# EAGLE board calculator_15-Digit (EAGLE 6.6.0), part 1 of 2
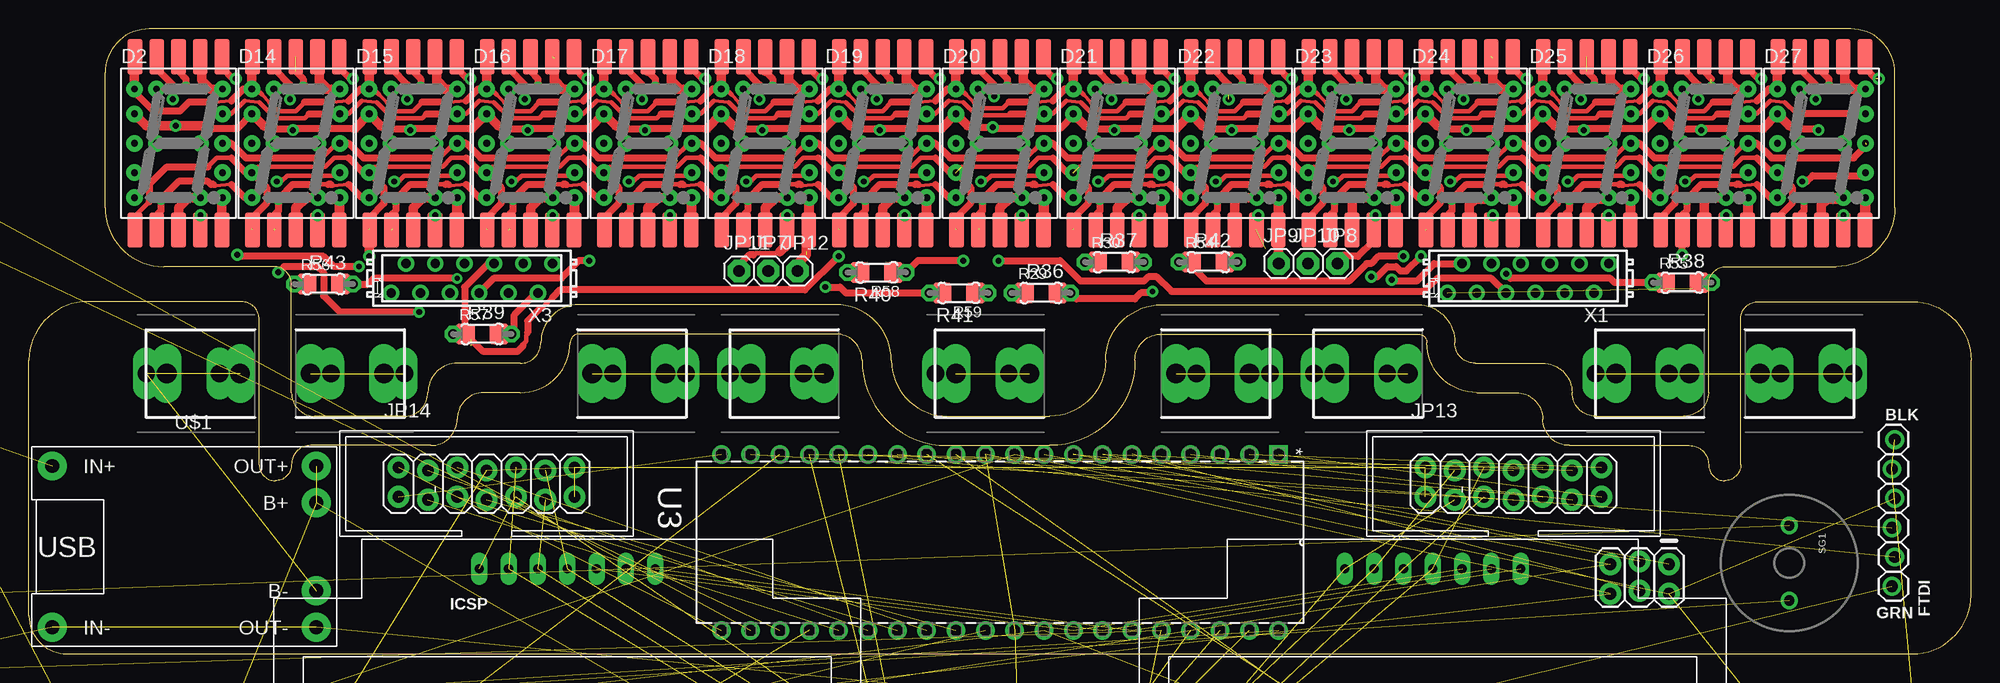
[diagram p4: board, top side]
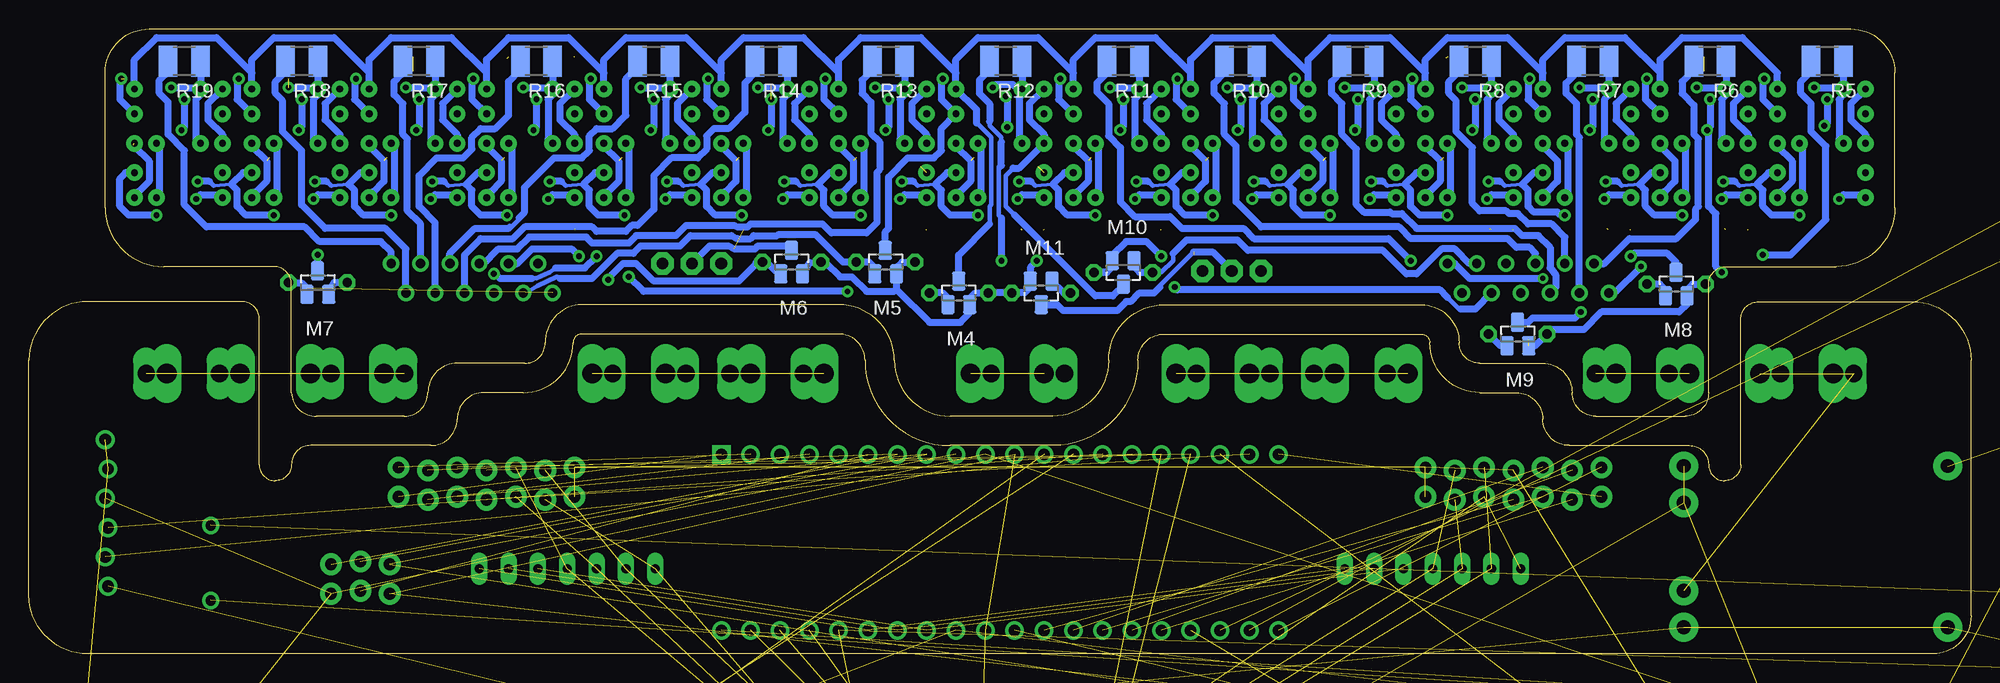
[diagram p5: board, bottom side, seen from below]

Size 168.15 x 54.1 mm. Coordinates in mm from the lower left corner, seen from the top.
Outline: 161.54,50.29 arc90 157.73,54.1
Outline: 10.41,54.1 arc90 6.6,50.29
Outline: 161.54,50.29 arc90 157.73,54.1
Outline: 10.41,54.1 arc90 6.6,50.29
Outline: 161.54,50.29 arc90 157.73,54.1
Outline: 10.41,54.1 arc90 6.6,50.29
Outline: 161.54,50.29 arc90 157.73,54.1
Outline: 10.41,54.1 arc90 6.6,50.29
Outline: 161.54,50.29 arc90 157.73,54.1
Outline: 157.73,54.1 10.41,54.1
Outline: 10.41,54.1 arc90 6.6,50.29
Outline: 6.6,50.29 6.6,38.61 arc90 11.68,33.53 21.21,33.53 arc-90 22.73,32 22.73,22.61 arc90 24.77,20.57 32.51,20.57 arc90 34.54,22.61 arc-90 37.08,25.15 42.55,25.15 arc90 44.32,26.92 arc-90 47.62,30.23 69.85,30.23 arc-90 74.68,25.4 arc90 79.5,20.57 88.39,20.57 arc90 93.22,25.4 arc-90 98.04,30.23 120.27,30.23 arc-90 123.44,26.92 arc90 125.22,25.15 131.06,25.15 arc-90 133.6,22.61 arc90 135.64,20.57 143.26,20.57 arc90 145.42,22.61 145.42,32 arc-90 146.94,33.53 156.46,33.53 arc90 161.54,38.61 161.54,50.29
Outline: 0,3.3 arc90 3.3,0 163.07,0 arc90 168.15,5.08 168.15,25.4 arc90 163.07,30.48 149.61,30.48 arc90 148.21,28.96 148.21,16.38 arc-90 146.81,14.99 arc-90 145.42,16.38 arc90 143.76,18.03 133.35,18.03 arc-90 131.06,20.32 arc90 128.78,22.61 125.35,22.61 arc-90 121.03,26.92 arc90 120.27,27.69 98.04,27.69 arc90 95.76,25.4 arc-90 88.39,18.03 79.5,18.03 arc-90 72.14,25.4 arc90 69.85,27.69 47.62,27.69 arc90 46.86,26.92 arc-90 42.55,22.61 39.37,22.61 arc90 37.08,20.32 arc-90 34.8,18.03 24.38,18.03 arc90 22.73,16.38 arc-90 21.34,14.99 arc-90 19.94,16.38 19.94,28.96 arc90 18.41,30.48 5.08,30.48 arc90 0,25.4 0,3.3
Copper layers (1*16): Top 0.035mm / dielectric 1.5mm / Bottom 0.035mm
Design rules "OSHPark-8mil-2layer": minimum track width 10mil, minimum drill 15mil, track to track 8mil, track to pad 8mil, pad to pad 8mil, via to via 8mil, smd to smd 8mil, copper to edge 8mil, drill to drill 8mil, minimum pad ring 12mil, minimum via ring 10mil, stop-mask expansion 4mil, vias tented up to drill 20mil, thermal gap 10mil
Net classes: 0 default: clearance 0.205 mm; 1 vcc: width 0.254 mm

## Footprints (pad centres in the part's own frame; a part is rotated, then mirrored left to right if it is on the bottom)
BATTERY-AAA-LEFT = drill 1.7 long: P1 -2.54,0; P2 3.81,0 | drill 1.5 long: P3 2.032,0; P4 -4.318,0
BATTERY-AAA-RIGHT = drill 1.7 long: M1 -3.81,0; M2 2.54,0 | drill 1.5 long: M3 4.318,0; M4 -2.032,0
C025_050-025X075 = drill 0.813 octagon: 1 -1.27,0; 2 1.27,0; 3 3.81,0
C1206K = smd 1.5 x 2: 1 -1.5,0; 2 1.5,0
C025-024X044 = drill 0.813 pad 1.422 octagon: 1 -1.27,0; 2 1.27,0
0805 = smd 0.8 x 1.2: 1 -0.9,0; 2 0.9,0
EIA3216 = smd 1.4 x 1.6: A 1.4,0; C -1.4,0
SMADIODE = smd 2.54 x 2.54: A 2.349,0; C -2.349,0
10MM_UNI = drill 0.6 pad 1.422: 1 -3.81,4.699; 2 -3.81,2.54; 3 -3.81,0; 4 -3.81,-2.54; 5 -3.81,-4.699; 6 3.81,-4.699; 7 3.81,-2.54; 8 3.81,0; 9 3.81,2.54; 10 3.81,4.699; 11 -1.905,4.699; 12 -1.905,0; 13 1.905,0; 14 1.905,-4.699 | smd 1.27 x 3.048: 21 -3.76,-7.5; 22 -1.88,-7.5; 23 0,-7.5; 24 1.88,-7.5; 25 3.76,-7.5; 26 3.76,7.5; 27 1.88,7.5; 28 0,7.5; 29 -1.88,7.5; 30 -3.76,7.5
SOT89 = smd 1 x 1.5: 1 -1.499,-1.981; 3 1.499,-1.981 | smd 1 x 2: 2 0,-1.727 | smd 2.2 x 3.7: 2@1 0,0.94
1X01-CLEANBIG = drill 1.016 pad 1.778: 1 0,0
2X3_LOCK = drill 1.016 pad 1.88: 1 0,0.127; 2 0,2.667; 3 2.54,-0.127; 4 2.54,2.413; 5 5.08,0.127; 6 5.08,2.667
1X06_LOCK = drill 1.016: 1 0,0; 2 2.54,-0.254; 3 5.08,0; 4 7.62,-0.254; 5 10.16,0; 6 12.7,-0.254
1X01 = drill 1.016 pad 1.93 octagon: 1 0,0
2X07 = drill 1.016 pad 1.88: 1 -7.62,-1.143; 2 -7.62,1.397; 3 -5.08,-1.397; 4 -5.08,1.143; 5 -2.54,-1.143; 6 -2.54,1.397; 7 0,-1.397; 8 0,1.143; 9 2.54,-1.143; 10 2.54,1.397; 11 5.08,-1.397; 12 5.08,1.143; 13 7.62,-1.143; 14 7.62,1.397
KEYPAD = drill 0.8 long: C_0 -2.54,0; C_1 -5.08,0; C_2 -7.62,0; R_0 0,0; R_1 2.54,0; R_2 5.08,0; R_3 7.62,0
SOT-23 = smd 1.143 x 1.651: 1 0.94,1.016; 2 -0.94,1.016; 3 0.025,-1.016
0204/7 = drill 0.813 octagon: 1 -3.81,0; 2 3.81,0
0204/5 = drill 0.813 octagon: 1 -2.54,0; 2 2.54,0
R1206 = smd 1.6 x 1.803: 1 -1.422,0; 2 1.422,0
R1210 = smd 1.6 x 2.7: 1 -1.4,0; 2 1.4,0
TACTILE-PTH-12MM = smd 2.3 x 2.4: P$1 7.1,-2.5; P$2 -7.1,-2.5; P$3 7.1,2.5; P$4 -7.1,2.5 | drill 1.2 long: P$11 6.25,-2.5; P$12 -6.25,-2.5; P$13 6.25,2.5; P$14 -6.25,2.5 | drill 1 long: P$15 0,-6.9; P$21 2.5,-2.5; P$22 -2.5,-2.5; P$23 2.5,2.5; P$24 -2.5,2.5 | hole 1.6: 0,4.5; 0,-4.5; 0,4.5; 0,-4.5
BUZZER-12MM-NS = drill 0.9: + 3.25,0; - -3.25,0
SO16 = smd 0.6 x 1.2: 1 -4.445,-2.8; 2 -3.175,-2.8; 3 -1.905,-2.8; 4 -0.635,-2.8; 5 0.635,-2.8; 6 1.905,-2.8; 7 3.175,-2.8; 8 4.445,-2.8; 9 4.445,2.8; 10 3.175,2.8; 11 1.905,2.8; 12 0.635,2.8; 13 -0.635,2.8; 14 -1.905,2.8; 15 -3.175,2.8; 16 -4.445,2.8
DIP254P1524X483-40 = drill 0.991 square: 1 -15.24,48.26 | drill 0.991: 2 -15.24,45.72; 3 -15.24,43.18; 4 -15.24,40.64; 5 -15.24,38.1; 6 -15.24,35.56; 7 -15.24,33.02; 8 -15.24,30.48; 9 -15.24,27.94; 10 -15.24,25.4; 11 -15.24,22.86; 12 -15.24,20.32; 13 -15.24,17.78; 14 -15.24,15.24; 15 -15.24,12.7; 16 -15.24,10.16; 17 -15.24,7.62; 18 -15.24,5.08; 19 -15.24,2.54; 20 -15.24,0; 21 0,0; 22 0,2.54; 23 0,5.08; 24 0,7.62; 25 0,10.16; 26 0,12.7; 27 0,15.24; 28 0,17.78; 29 0,20.32; 30 0,22.86; 31 0,25.4; 32 0,27.94; 33 0,30.48; 34 0,33.02; 35 0,35.56; 36 0,38.1; 37 0,40.64; 38 0,43.18; 39 0,45.72; 40 0,48.26
SOT23-5 = smd 0.55 x 1.2: 1 -0.95,-1.3; 2 0,-1.3; 3 0.95,-1.3; 4 0.95,1.3; 5 -0.95,1.3
BATTERY-CHARGER-LI-PROT = drill 1.2 pad 2.5: B+ 10.668,3.81; B- 10.668,-3.81; IN+ -12.192,6.985; IN- -12.192,-6.985; OUT+ 10.668,6.985; OUT- 10.668,-6.985
MICRO3 = smd 0.8 x 0.9: 1 -0.95,-1; 2 0.95,-1; 3 0,1
SOT89' = smd 0.559 x 1.194: GND -1.499,-0.597; VIN 0,-0.597; VOUT 1.499,-0.597 | smd 1.829 x 0.457: P$4 0,2.743
MICROMATCH-12 = drill 0.813: 1 6.985,1.27; 2 5.715,-1.27; 3 4.445,1.27; 4 3.175,-1.27; 5 1.905,1.27; 6 0.635,-1.27; 7 -0.635,1.27; 8 -1.905,-1.27; 9 -3.175,1.27; 10 -4.445,-1.27; 11 -5.715,1.27; 12 -6.985,-1.27
HC49U-V = drill 0.813: 1 -2.413,0; 2 2.413,0

## Placement (x,y rotation side)
BH4  HOLDER_AAA_LEFT1  [BATTERY-AAA-LEFT]  139.95,24.26 0 top
BH5  HOLDER_AAA_LEFT1  [BATTERY-AAA-LEFT]  82.8,24.26 0 top
BH6  HOLDER_AAA_RIGHT  [BATTERY-AAA-RIGHT]  28.19,24.26 0 top
BH7  HOLDER_AAA_LEFT1  [BATTERY-AAA-LEFT]  153.67,24.26 180 top
BH8  HOLDER_AAA_RIGHT  [BATTERY-AAA-RIGHT]  14.48,24.26 180 top
BH9  HOLDER_AAA_LEFT1  [BATTERY-AAA-LEFT]  115.57,24.26 0 top
BH10  HOLDER_AAA_RIGHT  [BATTERY-AAA-RIGHT]  52.58,24.26 0 top
BH11  HOLDER_AAA_LEFT1  [BATTERY-AAA-LEFT]  103.12,24.26 180 top
BH12  HOLDER_AAA_RIGHT  [BATTERY-AAA-RIGHT]  65.02,24.26 180 top
C1  100nF  [C025_050-025X075]  157.51,-46.99 180 top  (outside the outline)
C2  100nF  [C025_050-025X075]  170.1,-36.55 270 top  (outside the outline)
C3  100nF  [C025_050-025X075]  152.65,-36.27 270 top  (outside the outline)
C4  1µ  [C025_050-025X075]  -23.88,5.84 0 top  (outside the outline)
C5  100n  [C1206K]  -23.88,18.54 0 top  (outside the outline)
C6  10uF  [C025_050-025X075]  163.32,-20.04 0 top  (outside the outline)
C7  22pF  [C025-024X044]  159.33,-54.53 0 top  (outside the outline)
C8  22pF  [C025-024X044]  163.55,-56.06 180 top  (outside the outline)
C9  1µ  [C025_050-025X075]  -23.88,-1.78 0 top  (outside the outline)
C10  15n  [C1206K]  -26.42,-17.02 0 top  (outside the outline)
C11  1n  [0805]  -44.2,16 180 top  (outside the outline)
C12  0.1uF  [0805]  -28.96,-1.78 0 top  (outside the outline)
C14  1µ  [C025_050-025X075]  -9.53,17.78 270 top  (outside the outline)
C15  1µ  [C025_050-025X075]  -9.53,6.35 90 top  (outside the outline)
C16  0.1uF  [0805]  -54.36,-34.8 180 top  (outside the outline)
C18  100n  [C025_050-025X075]  -18.67,-22.22 0 top  (outside the outline)
C20  10uF  [EIA3216]  -54.36,-42.42 180 top  (outside the outline)
C21  10uF  [EIA3216]  -49.28,-34.8 180 top  (outside the outline)
C22  15n  [C1206K]  -49.28,-24.64 180 top  (outside the outline)
D1  SD103CW  [SMADIODE]  -51.82,-55.12 180 top  (outside the outline)
D2  SC40-11_UNISC40-11_UNI  [10MM_UNI]  12.95,44.2 0 top
D3  SD103CW  [SMADIODE]  -30.1,-4.45 0 top  (outside the outline)
D4  SD103CW  [SMADIODE]  5.33,-13.21 0 top  (outside the outline)
D5  SD103CW  [SMADIODE]  7.87,-9.4 0 top  (outside the outline)
D6  SD103CW  [SMADIODE]  -51.82,-47.5 180 top  (outside the outline)
D7  SD103CW  [SMADIODE]  -39.12,8.38 0 top  (outside the outline)
D8  SD103CW  [SMADIODE]  -59.44,-29.72 0 top  (outside the outline)
D9  SD103CW  [SMADIODE]  -46.74,41.4 0 top  (outside the outline)
D10  SD103CW  [SMADIODE]  -46.74,26.16 0 top  (outside the outline)
D11  SD103CW  [SMADIODE]  -26.42,-9.4 0 top  (outside the outline)
D12  SD103CW  [SMADIODE]  -26.42,-22.1 0 top  (outside the outline)
D14  SC40-11_UNISC40-11_UNI  [10MM_UNI]  23.11,44.2 0 top
D15  SC40-11_UNISC40-11_UNI  [10MM_UNI]  33.27,44.2 0 top
D16  SC40-11_UNISC40-11_UNI  [10MM_UNI]  43.43,44.2 0 top
D17  SC40-11_UNISC40-11_UNI  [10MM_UNI]  53.59,44.2 0 top
D18  SC40-11_UNISC40-11_UNI  [10MM_UNI]  63.75,44.2 0 top
D19  SC40-11_UNISC40-11_UNI  [10MM_UNI]  73.91,44.2 0 top
D20  SC40-11_UNISC40-11_UNI  [10MM_UNI]  84.07,44.2 0 top
D21  SC40-11_UNISC40-11_UNI  [10MM_UNI]  94.23,44.2 0 top
D22  SC40-11_UNISC40-11_UNI  [10MM_UNI]  104.39,44.2 0 top
D23  SC40-11_UNISC40-11_UNI  [10MM_UNI]  114.55,44.2 0 top
D24  SC40-11_UNISC40-11_UNI  [10MM_UNI]  124.71,44.2 0 top
D25  SC40-11_UNISC40-11_UNI  [10MM_UNI]  134.87,44.2 0 top
D26  SC40-11_UNISC40-11_UNI  [10MM_UNI]  145.03,44.2 0 top
D27  SC40-11_UNISC40-11_UNI  [10MM_UNI]  155.19,44.2 0 top
IC1  MCP170333MB  [SOT89]  -2.29,-50.04 0 top  (outside the outline)
JP1  RXD_1  [1X01-CLEANBIG]  84.96,-55.88 180 top  (outside the outline)
JP2  TXD_1  [1X01-CLEANBIG]  84.96,-51.31 180 top  (outside the outline)
JP4  RXD_1  [1X01-CLEANBIG]  85.09,-60.45 180 top  (outside the outline)
JP5  ICSP  [2X3_LOCK]  141.99,7.87 180 top
JP6  FTDI  [1X06_LOCK]  161.54,18.54 270 top
JP7  [1X01]  64.01,33.15 0 top
JP8  [1X01]  113.28,33.78 0 top
JP9  [1X01]  108.2,33.78 0 top
JP10  [1X01]  110.74,33.78 0 top
JP11  [1X01]  61.47,33.15 0 top
JP12  [1X01]  66.55,33.15 0 top
JP13  [2X07]  128.52,14.73 0 top
JP14  [2X07]  39.62,14.73 0 top
KP1  KEYPAD  [KEYPAD]  46.61,7.37 180 top
KP2  KEYPAD  [KEYPAD]  121.54,7.37 180 top
LOGO1  OSHW_LOGO_8MILX0150-NT  [OSHW_8X150_NOTEXT]  161.85,-50.7 270 bottom  (outside the outline)
LOGO2  OSHW_LOGO_6MILX0100-NT  [OSHW_6X100_NOTEXT]  159.13,-23.88 90 top  (outside the outline)
M1  IRLML2244  [SOT-23]  163.96,-26.16 90 top  (outside the outline)
M2  IRLML2244  [SOT-23]  -26.42,-39.88 0 top  (outside the outline)
M3  IRLML2244  [SOT-23]  5.33,-38.61 0 top  (outside the outline)
M4  IRLML2244  [SOT-23]  87.63,31.24 180 bottom
M5  IRLML2244  [SOT-23]  93.98,33.91 180 bottom
M6  IRLML2244  [SOT-23]  102.11,33.91 180 bottom
M7  IRLML2244  [SOT-23]  143.13,32.13 180 bottom
M8  IRLML2244  [SOT-23]  25.53,32 180 bottom
M9  IRLML2244  [SOT-23]  39.24,27.69 180 bottom
M10  IRLML2244  [SOT-23]  73.41,33.02 0 bottom
M11  IRLML2244  [SOT-23]  80.52,31.24 0 bottom
M12  IRLML2244  [SOT-23]  7.87,-44.96 0 top  (outside the outline)
R1  47k  [0204/7]  -12.07,-15.24 0 top  (outside the outline)
R2  6k8  [0204/5]  -39.12,-52.58 0 top  (outside the outline)
R3  6k8  [R1206]  -49.28,0.76 180 top  (outside the outline)
R4  100  [0204/7]  -12.07,-20.32 0 top  (outside the outline)
R5  22  [R1210]  12.45,51.31 180 bottom
R6  22  [R1210]  22.61,51.31 180 bottom
R7  22  [R1210]  32.77,51.31 180 bottom
R8  22  [R1210]  42.93,51.31 180 bottom
R9  22  [R1210]  53.09,51.31 180 bottom
R10  22  [R1210]  63.25,51.31 180 bottom
R11  22  [R1210]  73.41,51.31 180 bottom
R12  22  [R1210]  83.57,51.31 180 bottom
R13  22  [R1210]  93.73,51.31 180 bottom
R14  22  [R1210]  103.89,51.31 180 bottom
R15  22  [R1210]  114.05,51.31 180 bottom
R16  22  [R1210]  124.21,51.31 180 bottom
R17  22  [R1210]  134.37,51.31 180 bottom
R18  22  [R1210]  144.53,51.31 180 bottom
R19  22  [R1210]  154.69,51.31 180 bottom
R20  2R7  [0204/5]  -39.12,-14.48 0 top  (outside the outline)
R21  6k8  [0204/7]  -28.58,49.53 0 top  (outside the outline)
R22  6k8  [0204/7]  -28.58,44.45 0 top  (outside the outline)
R23  6k8  [R1206]  -41.66,-44.96 0 top  (outside the outline)
R24  2R7  [R1206]  -41.66,-6.86 0 top  (outside the outline)
R25  100  [0204/7]  -21.34,10.92 0 top  (outside the outline)
R26  6k8  [0204/5]  -51.82,8.38 180 top  (outside the outline)
R27  6k8  [R1206]  -26.42,-29.72 0 top  (outside the outline)
R28  47k  [0204/7]  -23.88,-44.96 0 top  (outside the outline)
R29  3k3  [0204/5]  87.63,31.24 0 top
R30  3V3  [0204/5]  93.98,33.91 0 top
R31  100  [0204/7]  -0.63,-5.08 0 top  (outside the outline)
R32  100  [0204/7]  -8.25,-1.27 0 top  (outside the outline)
R33  1k  [0204/7]  -12.07,-52.07 0 top  (outside the outline)
R34  6k8  [0204/7]  -12.07,-40.64 0 top  (outside the outline)
R35  3k3  [0204/7]  -12.07,-48.26 0 top  (outside the outline)
R36  3k3  [R1206]  87.63,31.24 0 top
R37  3k3  [R1206]  93.98,33.91 0 top
R38  3k3  [R1206]  143.13,32.13 0 top
R39  3k3  [R1206]  39.24,27.69 0 top
R40  3k3  [R1206]  73.41,33.02 180 top
R41  3k3  [R1206]  80.52,31.24 180 top
R42  3k3  [R1206]  102.11,33.91 0 top
R43  3k3  [R1206]  25.53,32 0 top
R44  47k  [0204/7]  -23.88,-50.04 0 top  (outside the outline)
R45  56R  [R1206]  -49.28,33.78 0 top  (outside the outline)
R46  47k  [0204/7]  10.41,-50.04 0 top  (outside the outline)
R47  47k  [0204/7]  10.41,-55.12 0 top  (outside the outline)
R48  3k3  [0204/7]  -12.07,-44.45 0 top  (outside the outline)
R50  6k8  [0204/7]  -12.07,-10.16 0 top  (outside the outline)
R51  3k3  [0204/7]  -12.07,-35.56 0 top  (outside the outline)
R54  3k3  [0204/5]  102.11,33.91 0 top
R55  3k3  [0204/5]  143.13,32.13 0 top
R56  3k3  [0204/5]  25.53,32 0 top
R57  3k3  [0204/5]  39.24,27.69 0 top
R58  3k3  [0204/5]  73.41,33.02 180 top
R59  3k3  [0204/5]  80.52,31.24 180 top
S3  B3F-4150  [TACTILE-PTH-12MM]  -56.9,-11.94 180 top  (outside the outline)
SG1  BUZZERNS  [BUZZER-12MM-NS]  152.4,7.87 270 top
U1  74HC4051_MUX  [SO16]  84.07,-20.83 180 top  (outside the outline)
U3  ATMEGA1284P-PU  [DIP254P1524X483-40]  59.94,2.03 270 top
U4  TLV70033  [SOT23-5]  -49.28,-39.88 180 top  (outside the outline)
U$1  BATTERY-CHARGER-LI-PROT  [BATTERY-CHARGER-LI-PROT]  14.22,9.27 0 top
U$2  IRLML6244  [MICRO3]  -23.24,35.43 0 top  (outside the outline)
U$3  HT7333  [SOT89']  -2.29,-51.31 0 top  (outside the outline)
X1  MICROMATCH-12  [MICROMATCH-12]  129.79,32.51 180 top
X3  MICROMATCH-12  [MICROMATCH-12]  38.35,32.51 180 top
Y2  12MHz  [HC49U-V]  161.93,-38.86 180 top  (outside the outline)